# EAGLE design quadcopter-control-board (EAGLE 6.2)
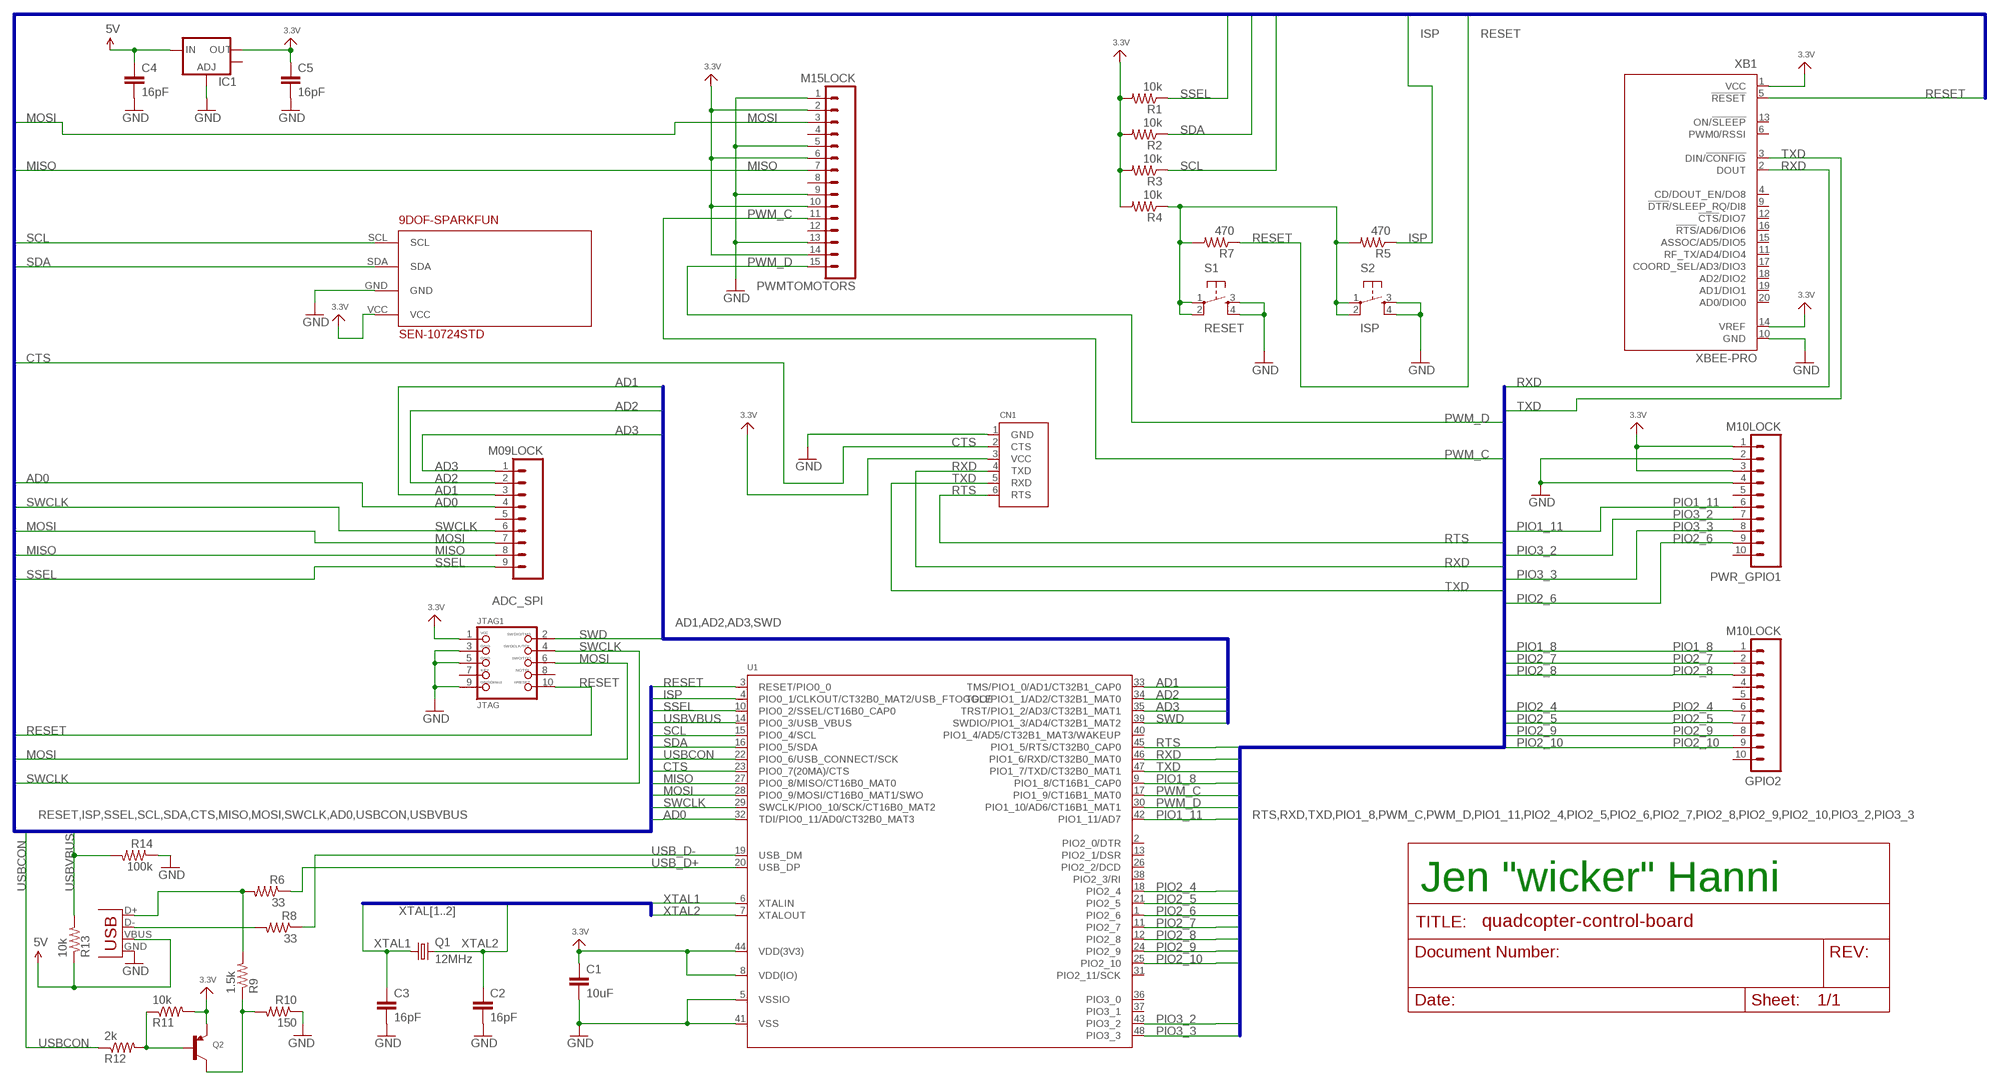
[diagram p0: schematic, sheet 1]

## Parts
9DOF-SPARKFUN  SEN-10724STD  [SPARKFUN-9DOF]
ADC_SPI  M09LOCK  [1X09_LOCK]
C1  10uF  CAP0603-CAP  [0603-CAP]
C2  16pF  CAP0603-CAP  [0603-CAP]
C3  16pF  CAP0603-CAP  [0603-CAP]
C4  16pF  CAP0603-CAP  [0603-CAP]
C5  16pF  CAP0603-CAP  [0603-CAP]
CN1  FTDIUSBCABLE  [1X06_ROUND]
GPIO2  M10LOCK  [1X10_LOCK]
IC1  V_REG_LM1117SOT223  [SOT223]
JTAG1  JTAG  JTAG-CORTEXM3MOLEX  [CORTEXM3_SWD10_MOLEX]
PWMTOMOTORS  M15LOCK  [1X15_LOCK]
PWR_GPIO1  M10LOCK  [1X10_LOCK]
Q1  12MHz  CRYSTALCTS406  [CTS406]
Q2  TRANSISTOR_PNPSOT23-REFLOW  [SOT23-R]
R1  10k  RESISTOR0603-RES  [0603-RES]
R2  10k  RESISTOR0603-RES  [0603-RES]
R3  10k  RESISTOR0603-RES  [0603-RES]
R4  10k  RESISTOR0603-RES  [0603-RES]
R5  470  RESISTOR0603-RES  [0603-RES]
R6  33  RESISTOR0603-RES  [0603-RES]
R7  470  RESISTOR0603-RES  [0603-RES]
R8  33  RESISTOR0603-RES  [0603-RES]
R9  1.5k  RESISTOR0603-RES  [0603-RES]
R10  150  RESISTOR0603-RES  [0603-RES]
R11  10k  RESISTOR0603-RES  [0603-RES]
R12  2k  RESISTOR0603-RES  [0603-RES]
R13  10k  RESISTOR0603-RES  [0603-RES]
R14  100k  RESISTOR0603-RES  [0603-RES]
S1  RESET  TAC_SWITCHSMD  [TACTILE_SWITCH_SMD]
S2  ISP  TAC_SWITCHSMD  [TACTILE_SWITCH_SMD]
U1  LPC1343_QFP  [LQFP48]
X1  USB-SMD-NS  [USB-MINIB-NOSTOP]
XB1  XBEE-PRO  [XBEE-PRO]

## Nets
3.3V: 9DOF-SPARKFUN.VCC C1.1 C5.1 CN1.3(VCC) IC1.2(OUT) JTAG1.1 PWMTOMOTORS.2 PWMTOMOTORS.6 PWMTOMOTORS.10 PWMTOMOTORS.14 PWR_GPIO1.1 PWR_GPIO1.3 Q2.2(E) R1.2 R2.2 R3.2 R4.2 R11.2 U1.8(VDD(IO)) U1.44(VDD(3V3)) XB1.1(VCC) XB1.14(VREF)
5V: C4.1 IC1.3(IN) R13.1 X1.VBUS
AD0: ADC_SPI.4 U1.32(TDI/PIO0_11/AD0/CT32B0_MAT3)
AD1: ADC_SPI.3 U1.33(TMS/PIO1_0/AD1/CT32B1_CAP0)
AD2: ADC_SPI.2 U1.34(TDO/PIO1_1/AD2/CT32B1_MAT0)
AD3: ADC_SPI.1 U1.35(TRST/PIO1_2/AD3/CT32B1_MAT1)
CTS: CN1.2(CTS) U1.23(PIO0_7(20MA)/CTS)
GND: 9DOF-SPARKFUN.GND C1.2 C2.2 C3.2 C4.2 C5.2 CN1.1(GND) IC1.1(ADJ) JTAG1.3 JTAG1.5 JTAG1.9 PWMTOMOTORS.1 PWMTOMOTORS.5 PWMTOMOTORS.9 PWMTOMOTORS.13 PWR_GPIO1.2 PWR_GPIO1.4 R10.1 R14.1 S1.3 S1.4 S2.3 S2.4 U1.5(VSSIO) U1.41(VSS) X1.GND XB1.10(GND)
ISP: R5.1 U1.4(PIO0_1/CLKOUT/CT32B0_MAT2/USB_FTOGGLE)
MISO: ADC_SPI.8 PWMTOMOTORS.7 U1.27(PIO0_8/MISO/CT16B0_MAT0)
MOSI: ADC_SPI.7 JTAG1.6 PWMTOMOTORS.3 U1.28(PIO0_9/MOSI/CT16B0_MAT1/SWO)
N$1: R6.2 R9.2 X1.D+
N$2: R8.2 X1.D-
N$4: Q2.3(C) R9.1 R10.2
N$5: Q2.1(B) R11.1 R12.2
N$7: R4.1 R5.2 R7.2 S1.1 S1.2 S2.1 S2.2
PIO1_8: GPIO2.1 U1.9(PIO1_8/CT16B1_CAP0)
PIO1_11: PWR_GPIO1.6 U1.42(PIO1_11/AD7)
PIO2_4: GPIO2.6 U1.18(PIO2_4)
PIO2_5: GPIO2.7 U1.21(PIO2_5)
PIO2_6: PWR_GPIO1.9 U1.1(PIO2_6)
PIO2_7: GPIO2.2 U1.11(PIO2_7)
PIO2_8: GPIO2.3 U1.12(PIO2_8)
PIO2_9: GPIO2.8 U1.24(PIO2_9)
PIO2_10: GPIO2.9 U1.25(PIO2_10)
PIO3_2: PWR_GPIO1.7 U1.43(PIO3_2)
PIO3_3: PWR_GPIO1.8 U1.48(PIO3_3)
PWM_C: PWMTOMOTORS.11 U1.17(PIO1_9/CT16B1_MAT0)
PWM_D: PWMTOMOTORS.15 U1.30(PIO1_10/AD6/CT16B1_MAT1)
RESET: JTAG1.10 R7.1 U1.3(RESET/PIO0_0) XB1.5(!RESET)
RTS: CN1.6(RTS) U1.45(PIO1_5/RTS/CT32B0_CAP0)
RXD: CN1.4(TXD) U1.46(PIO1_6/RXD/CT32B0_MAT0) XB1.2(DOUT)
SCL: 9DOF-SPARKFUN.SCL R3.1 U1.15(PIO0_4/SCL)
SDA: 9DOF-SPARKFUN.SDA R2.1 U1.16(PIO0_5/SDA)
SSEL: ADC_SPI.9 R1.1 U1.10(PIO0_2/SSEL/CT16B0_CAP0)
SWCLK: ADC_SPI.6 JTAG1.4 U1.29(SWCLK/PIO0_10/SCK/CT16B0_MAT2)
SWD: JTAG1.2 U1.39(SWDIO/PIO1_3/AD4/CT32B1_MAT2)
TXD: CN1.5(RXD) U1.47(PIO1_7/TXD/CT32B0_MAT1) XB1.3(DIN/!CONFIG)
USB_D+: R6.1 U1.20(USB_DP)
USB_D-: R8.1 U1.19(USB_DM)
USBCON: R12.1 U1.22(PIO0_6/USB_CONNECT/SCK)
USBVBUS: R13.2 R14.2 U1.14(PIO0_3/USB_VBUS)
XTAL1: C3.1 Q1.1 U1.6(XTALIN)
XTAL2: C2.1 Q1.3 U1.7(XTALOUT)
Unconnected: ADC_SPI.5 GPIO2.4 GPIO2.5 GPIO2.10 IC1.4(OUT) JTAG1.7 JTAG1.8 PWMTOMOTORS.4 PWMTOMOTORS.8 PWMTOMOTORS.12 PWR_GPIO1.5 PWR_GPIO1.10 U1.2(PIO2_0/DTR) U1.13(PIO2_1/DSR) U1.26(PIO2_2/DCD) U1.31(PIO2_11/SCK) U1.36(PIO3_0) U1.37(PIO3_1) U1.38(PIO2_3/RI) U1.40(PIO1_4/AD5/CT32B1_MAT3/WAKEUP) XB1.4(CD/DOUT_EN/DO8) XB1.6(PWM0/RSSI) XB1.9(!DTR!/SLEEP_RQ/DI8) XB1.11(RF_TX/AD4/DIO4) XB1.12(!CTS!/DIO7) XB1.13(ON/!SLEEP) XB1.15(ASSOC/AD5/DIO5) XB1.16(!RTS!/AD6/DIO6) XB1.17(COORD_SEL/AD3/DIO3) XB1.18(AD2/DIO2) XB1.19(AD1/DIO1) XB1.20(AD0/DIO0)

## Buses
XTAL[1..2]
RESET,ISP,SSEL,SCL,SDA,CTS,MISO,MOSI,SWCLK,AD0,USBCON,USBVBUS
AD1,AD2,AD3,SWD
RTS,RXD,TXD,PIO1_8,PWM_C,PWM_D,PIO1_11,PIO2_4,PIO2_5,PIO2_6,PIO2_7,PIO2_8,PIO2_9,PIO2_10,PIO3_2,PIO3_3

## Notes on the sheet
- Jen "wicker" Hanni

## Library data of the parts
9DOF-SPARKFUN = wicker:SEN-10724
ADC_SPI = sparkfun:M09: Header 9 Standard 9-pin 0.1" header. Use with straight break away headers (SKU : PRT-00116), right angle break away headers (PRT-00553), swiss pins (PRT-00743), machine pins (PRT-00117), and female headers (PRT-00115).
C1-C5 = sparkfun:CAP: Capacitor Standard 0603 ceramic capacitor, and 0.1" leaded capacitor.
CN1 = microbuilder:FTDIUSBCABLE: FTDI TTL-232R USB Cable Connector for FTDI's USB->RS232 Cable
GPIO2 PWR_GPIO1 = sparkfun:M10: Header 10 Standard 10-pin 0.1" header. Use with straight break away headers (SKU : PRT-00116), right angle break away headers (PRT-00553), swiss pins (PRT-00743), machine pins (PRT-00117), and female headers (PRT-00115).
IC1 = sparkfun:V_REG_LM1117: Voltage Regulator LM1117 Standard adjustable voltage regulator but in SMD form. Spark Fun Electronics SKU : COM-00595
JTAG1 = microbuilder:JTAG-CORTEXM3: Serial Wire (SW-DP) Connector This standard 0.05" 10-pin connector is for use with the Cortex M0/M3's native SWD (serial wire debugger) interface (SW-DP). Some boards support a 20-pin combined JTAG+SWD connector (SWJ-DP), such as the LPC1700 family, but many smaller devices only work with SWD which typically use the smaller 10-pin SW-DP connecter (the LPC1300 family, for example, only supports SWD). 2x05 1.27mm/0.05" Connector: This is the standard SMT connector defined by ARM for all Cortex devices, and should be used in most situations and for forward-compatibility since any new devices coming to market will likely use this connector. MOLEX 10 Pin 0.1" Connector: This 0.1" 10 pin connector has the same pin layout as the standard 0.05" connector, but is easier to work with if you are using standard jumper wires or custom cables to connect your SWD hardware. MOLEX 20 Pin 0.1" Connector: This 0.1" 20 pin connector is the same model used for ARM7/ARM9 JTAG debuggers, but is connected to match the pins on the Segger J-Link for ARM (which supports both JTAG and SWD debugging). See the following document from ARM for more information on Cortex M3 Debug Connectors: http://infocenter.arm.com/help/topic/com.arm.doc.faqs/attached/13634/cortex_debug_connectors.pdf And the following page for an overview with images of the different connector types: http://www.keil.com/peripherals/coresight/connectors.asp
PWMTOMOTORS = sparkfun:M15: Header 15 Standard 15-pin 0.1" header. Use with straight break away headers (SKU : PRT-00116), right angle break away headers (PRT-00553), swiss pins (PRT-00743), machine pins (PRT-00117), and female headers (PRT-00115).
Q1 = crystal:CRYSTAL: CRYSTAL
Q2 = microbuilder:TRANSISTOR_PNP: PNP Transistor Transistor (PNP) 800mA 60V, 1.6V VCE @ 500mA [Digikey: MMBT2907AFSTR-ND] Transistor (PNP) Low Sat - 1.5A 20V, 260mV VCE @ 400mA [Digikey: ZXTP25020DFLTR-ND] SOT23-R - SOT23 footprint optimised for use with solder paste and reflow ovens. SOT23-W - SOT23 footprint optimised for hand-soldering (larger pads).
R1-R14 = sparkfun:RESISTOR: Resistor Basic schematic elements and footprints for 0603, 1206, and PTH resistors.
S1 S2 = sparkfun:TAC_SWITCH: Momentary Switch Button commonly used for reset or general input. Spark Fun Electronics SKU : COM-00097
U1 = microbuilder:LPC1343_QFP: LPC1343 72 MHz 32-bit ARM Cortex-M3 microcontroller. 32 kB Flash, 8 kB SRAM, USB Device Mouser: 771-LPC1343FBD48151 Digikey: 568-4945-ND; DIGIKEY#: 568-4945-ND; MANF: NXP; MANF#: LPC1343FBD48,151
X1 = sparkfun:USB: USB Connectors USB-B-PTH is fully proven SKU : PRT-00139 USB-miniB is fully proven SKU : PRT-00587 USB-A-PCB is untested. USB-A-H is throughly reviewed, but untested. Spark Fun Electronics SKU : PRT-00437 USB-B-SMT is throughly reviewed, but untested. Needs silkscreen touching up. USB-A-S has not been used/tested USB-MB-H has not been used/tested
XB1 = microbuilder:XBEE: XBee (TM) /XBee-PRO(TM) OEM RF Modules Source: MaxStream, Inc. xbee_productmanual.pdf

## Board
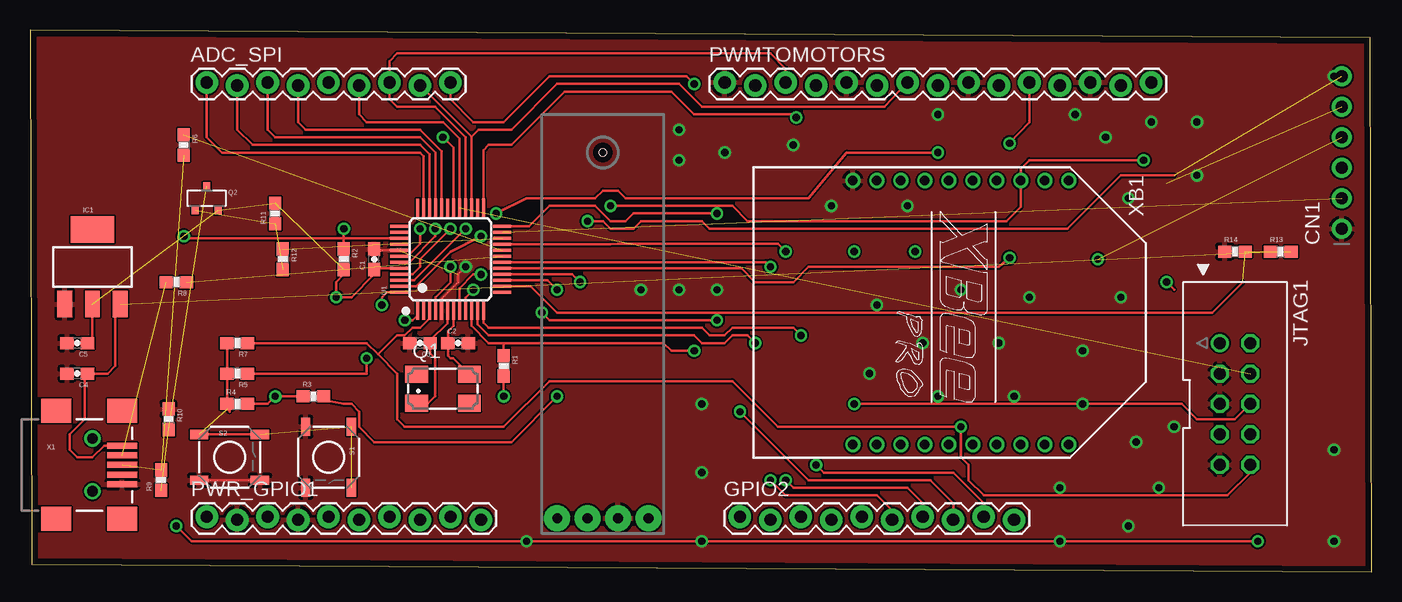
[diagram p1: board, top side]
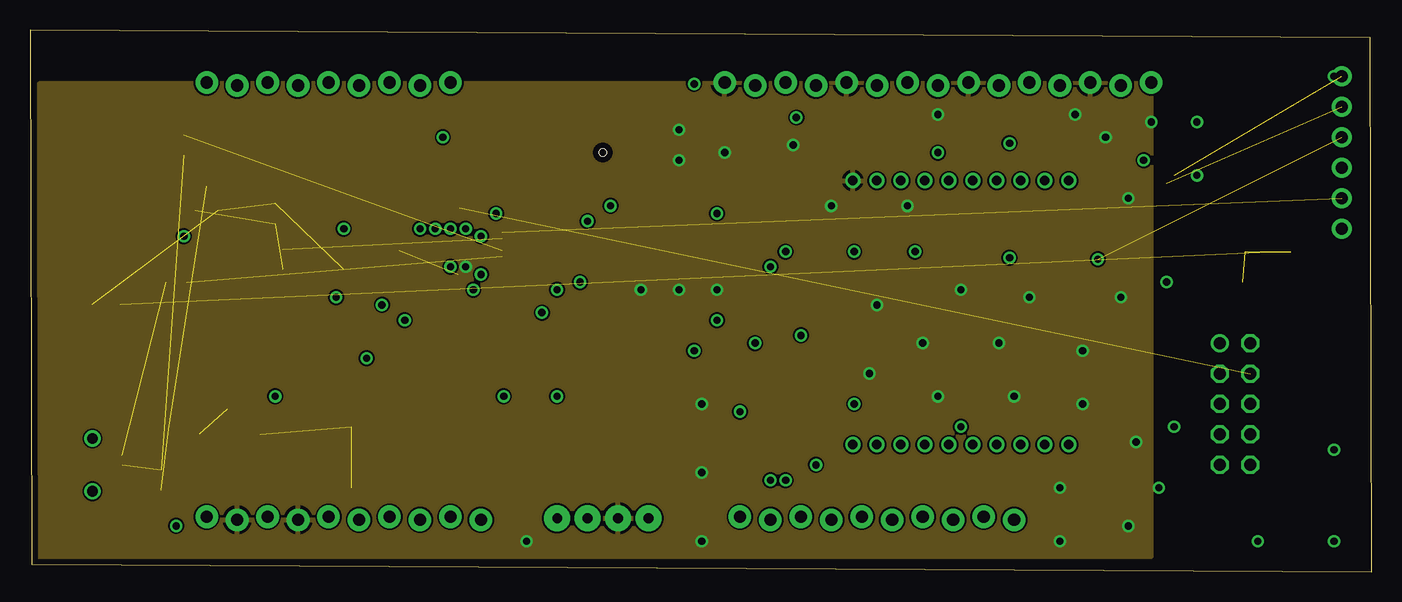
[diagram p2: board, inner layer $GND]
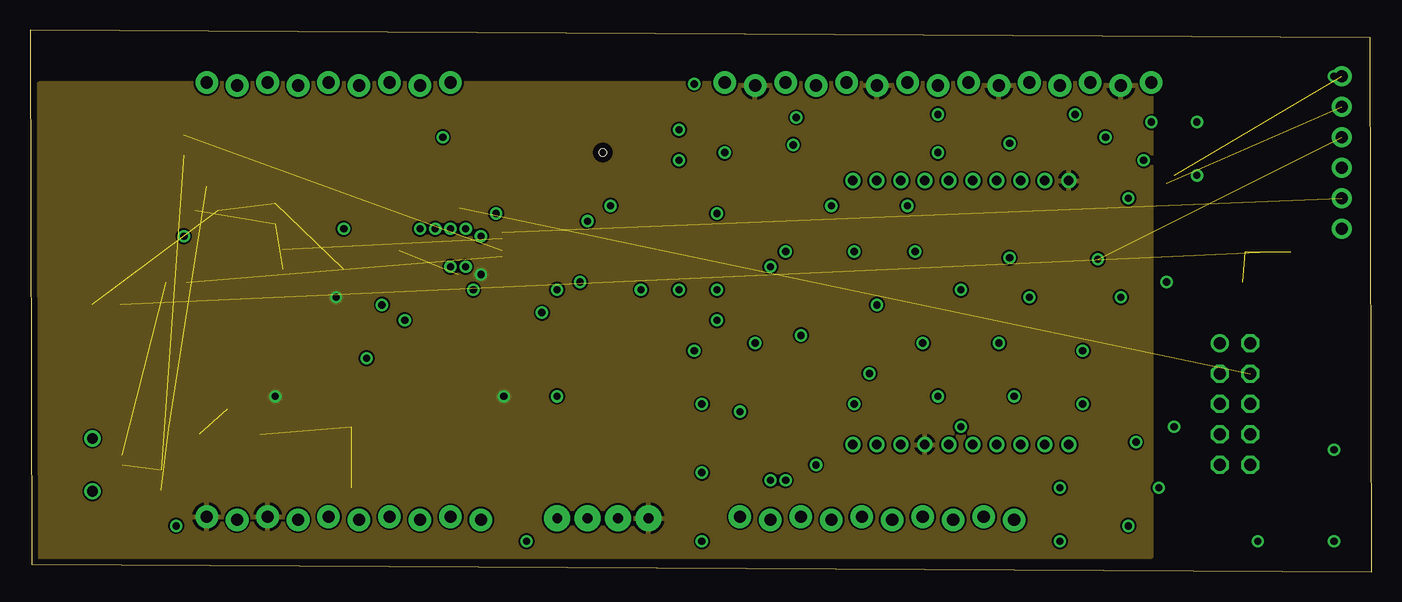
[diagram p3: board, inner layer $3.3V]
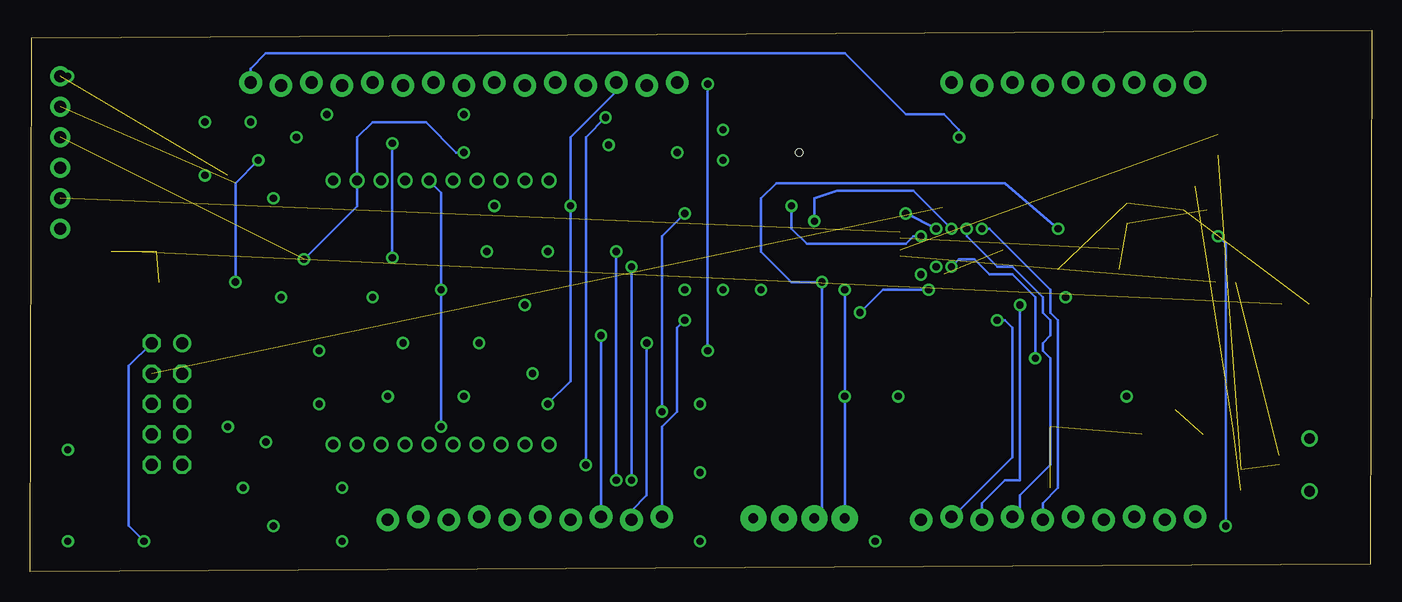
[diagram p4: board, bottom side, seen from below]

Size 111.87 x 45.14 mm. Coordinates in mm from the lower left corner, seen from the top.
Outline: 0.13,0.64 111.87,0 111.74,44.5 0,45.14 0.13,0.64
Copper layers (1+2*3+16): Top 0.0432mm / dielectric 0.3048mm / $GND 0.0356mm / dielectric 0.7112mm / $3.3V 0.0356mm / dielectric 0.3048mm / Bottom 0.0432mm
Design rules "eagle_sunstone_4lr_rules_v1.3_modifid": minimum track width 6mil, minimum drill 8mil, track to track 6mil, track to pad 6mil, pad to pad 6mil, via to via 6mil, smd to smd 6mil, copper to edge 20mil, drill to drill 16mil, minimum pad ring 0.2118mm, minimum via ring 0.2118mm, stop-mask expansion 3mil, vias tented up to drill 0mil, thermal gap 10mil

### Footprints (pad centres in the part's own frame; a part is rotated, then mirrored left to right if it is on the bottom)
SPARKFUN-9DOF = drill 0.8 pad 2.184 round: GND 1.27,3.81; SCL 1.27,8.89; SDA 1.27,6.35; VCC 1.27,1.27 | hole 0.6: 31.75,5.08
1X09_LOCK = drill 1.016 pad 1.88 round: 1 0,0.127; 2 2.54,-0.127; 3 5.08,0.127; 4 7.62,-0.127; 5 10.16,0.127; 6 12.7,-0.127; 7 15.24,0.127; 8 17.78,-0.127; 9 20.32,0.127
0603-CAP = smd 1.1 x 1: 1 -0.85,0; 2 0.85,0
1X06_ROUND = drill 1 pad 1.676 round: 1 -6.35,0; 2 -3.81,0; 3 -1.27,0; 4 1.27,0; 5 3.81,0; 6 6.35,0
1X10_LOCK = drill 1.016 pad 1.88 round: 1 0,0.127; 2 2.54,-0.127; 3 5.08,0.127; 4 7.62,-0.127; 5 10.16,0.127; 6 12.7,-0.127; 7 15.24,0.127; 8 17.78,-0.127; 9 20.32,0.127; 10 22.86,-0.127
SOT223 = smd 1.219 x 2.235: 1 -2.311,-3.099; 2 0,-3.099; 3 2.311,-3.099 | smd 3.6 x 2.2: 4 0,3.099
CORTEXM3_SWD10_MOLEX = drill 1 round: 1 -5.08,-1.27 | drill 1 octagon: 2 -5.08,1.27; 3 -2.54,-1.27; 4 -2.54,1.27; 5 0,-1.27; 6 0,1.27; 7 2.54,-1.27; 8 2.54,1.27; 9 5.08,-1.27; 10 5.08,1.27
1X15_LOCK = drill 1.016 pad 1.88 round: 1 0,0.127; 2 2.54,-0.127; 3 5.08,0.127; 4 7.62,-0.127; 5 10.16,0.127; 6 12.7,-0.127; 7 15.24,0.127; 8 17.78,-0.127; 9 20.32,0.127; 10 22.86,-0.127; 11 25.4,0.127; 12 27.94,-0.127; 13 30.48,0.127; 14 33.02,-0.127; 15 35.56,0.127
CTS406 = smd 1.9 x 1.4: 1 -2.2,-1.2; 2 2.2,-1.2; 3 2.2,1.2; 4 -2.2,1.2
SOT23-R = smd 0.6 x 0.7: 1 -0.95,-1; 2 0.95,-1; 3 0,1
0603-RES = smd 1.1 x 1: 1 -0.85,0; 2 0.85,0
TACTILE_SWITCH_SMD = smd 1.524 x 0.762: 1 -2.54,1.905; 2 2.54,1.905; 3 -2.54,-1.905; 4 2.54,-1.905
LQFP48 = smd 1.5 x 0.25: 1 -4.3,2.75; 2 -4.3,2.25; 3 -4.3,1.75; 4 -4.3,1.25; 5 -4.3,0.75; 6 -4.3,0.25; 7 -4.3,-0.25; 8 -4.3,-0.75; 9 -4.3,-1.25; 10 -4.3,-1.75; 11 -4.3,-2.25; 12 -4.3,-2.75; 25 4.3,-2.75; 26 4.3,-2.25; 27 4.3,-1.75; 28 4.3,-1.25; 29 4.3,-0.75; 30 4.3,-0.25; 31 4.3,0.25; 32 4.3,0.75; 33 4.3,1.25; 34 4.3,1.75; 35 4.3,2.25; 36 4.3,2.75 | smd 0.25 x 1.5: 13 -2.75,-4.3; 14 -2.25,-4.3; 15 -1.75,-4.3; 16 -1.25,-4.3; 17 -0.75,-4.3; 18 -0.25,-4.3; 19 0.25,-4.3; 20 0.75,-4.3; 21 1.25,-4.3; 22 1.75,-4.3; 23 2.25,-4.3; 24 2.75,-4.3; 37 2.75,4.3; 38 2.25,4.3; 39 1.75,4.3; 40 1.25,4.3; 41 0.75,4.3; 42 0.25,4.3; 43 -0.25,4.3; 44 -0.75,4.3; 45 -1.25,4.3; 46 -1.75,4.3; 47 -2.25,4.3; 48 -2.75,4.3
USB-MINIB-NOSTOP = smd 2.5 x 0.5: D+ 2.5,0; D- 2.5,0.8; GND 2.5,-1.6; ID 2.5,-0.8; VBUS 2.5,1.6 | smd 2.5 x 2: G1 -3,-4.5; G2 -3,4.5; G3 2.5,4.5; G4 2.5,-4.5 | drill 0.9 pad 0.8 round: H1 0,2.2 | drill 0.9 pad 0.787 round: H2 0,-2.2
XBEE-PRO = drill 0.8 pad 1.27 round: 1 -11,9; 2 -11,7; 3 -11,5; 4 -11,3; 5 -11,1; 6 -11,-1; 7 -11,-3; 8 -11,-5; 9 -11,-7; 10 -11,-9; 11 11,-9; 12 11,-7; 13 11,-5; 14 11,-3; 15 11,-1; 16 11,1; 17 11,3; 18 11,5; 19 11,7; 20 11,9

### Placement (x,y rotation side)
9DOF-SPARKFUN  52.83,3.17 90 top
ADC_SPI  14.73,40.64 0 top
C1  28.7,26.04 90 top
C2  35.69,19.05 0 top
C3  32.51,19.05 180 top
C4  3.94,16.51 180 top
C5  3.94,19.05 180 top
CN1  109.35,34.92 90 top
GPIO2  59.18,4.45 0 top
IC1  5.21,25.4 0 top
JTAG1  100.46,13.97 270 top
PWMTOMOTORS  57.91,40.64 0 top
PWR_GPIO1  14.73,4.45 0 top
Q1  34.42,15.24 0 top
Q2  14.73,31.12 0 top
R1  39.5,17.15 270 top
R2  26.16,26.04 270 top
R3  23.62,14.61 0 top
R4  17.27,13.97 0 top
R5  17.27,16.51 180 top
R6  12.83,35.56 270 top
R7  17.27,19.05 180 top
R8  12.19,24.13 180 top
R9  10.92,7.62 90 top
R10  11.56,12.7 270 top
R11  20.45,29.85 90 top
R12  21.08,26.04 270 top
R13  104.27,26.67 0 top
R14  100.46,26.67 0 top
S1  24.89,9.53 270 top
S2  16.64,9.53 0 top
U1  35.05,26.04 90 top
X1  5.21,8.89 0 top
XB1  77.6,21.59 270 top

### Tracks (layer width: path | path; a pad name or v marks a point on that pad's centre or on a via)
3.3V  (via drill 0.6)  (3 unrouted)
  Top 0.203: v39.5,14.61 R1.2 | R2.2 26.16,24.77 25.53,24.13 v25.53,22.86 26.8,22.86 28.7,24.77 C1.1 28.8,25.29 U1.44 | U1.8 35.8,23.61 36.96,24.77 v37.59,24.77 | R3.2 v20.45,14.61 19.81,13.97 R4.2 | IC1.2 5.21,19.47 C5.1
  pour $3.3V: 0.76,40.64 0.76,1.27 93.47,1.27 93.47,40.64
5V  (1 unrouted)
  Top 0.203: X1.VBUS 6.17,10.49 5.21,9.53 3.94,9.53 3.3,10.16 3.3,11.43 4.57,12.7 4.57,16.3 C4.1 6.48,16.51 7.11,17.15 7.11,21.9 IC1.3
AD0
  Top 0.203: U1.32 34.3,35.04 32.51,36.83 22.99,36.83 22.35,37.46 ADC_SPI.4
AD1
  Top 0.203: U1.33 33.8,34.91 32.51,36.2 20.45,36.2 19.81,36.83 ADC_SPI.3
AD2
  Top 0.203: U1.34 33.3,34.77 32.51,35.56 18.54,35.56 17.27,36.83 ADC_SPI.2
AD3
  Top 0.203: ADC_SPI.1 14.73,36.2 16,34.92 32.51,34.92 32.8,34.63 U1.35
CTS  (1 unrouted)
GND  (via drill 0.6, 0.6 pad 0.2)  (1 unrouted)
  Top 0.203: C1.2 28.8,26.79 U1.41 28.59,26.79 | S2.3 S2.4 | U1.5 34.3,22.75 35.69,24.13 35.69,24.77 v36.32,25.4
  other vias: 54.1,36.83 54.1,34.29 57.91,34.92 63.63,35.56 66.8,30.48 73.15,30.48 75.69,38.1 50.93,23.5 57.28,23.5 54.1,23.5 41.4,2.54 56.01,2.54 56.01,8.26 56.01,13.97 69.98,16.51 74.42,19.05 70.61,22.23 77.6,23.5 83.31,22.86 87.76,18.42 82.04,14.61 80.77,19.05 75.69,14.61 87.76,13.97 92.2,10.79 95.38,12.06 108.71,10.16 94.11,6.98 108.71,2.54 91.57,3.81 85.85,2.54 85.85,6.98 97.28,33.02 97.28,37.46 108.71,41.27 93.47,37.46 89.66,36.2 87.12,38.1 91.57,31.12 90.93,22.86
  pour $GND: 0.76,40.64 0.76,1.27 93.47,1.27 93.47,40.64
  pour Top: 0.76,44.45 111.25,43.81 111.25,0.64 0.76,1.27
ISP  (via drill 0.6)
  Top 0.203: v28.07,17.78 28.07,16.51 R5.1 | U1.4 33.8,22.88 35.05,24.13 v35.05,25.4
  Bottom 0.203: v28.07,17.78 28.07,22.86 29.97,24.77 31.88,24.77 33.15,26.04 34.42,26.04 v35.05,25.4
MISO
  Top 0.203: 36.8,36.22 U1.27 36.81,30.34 | 36.8,36.22 ADC_SPI.8 | PWMTOMOTORS.7 71.25,38.73 56.01,38.73 54.1,40.64 43.94,40.64 40.13,36.83 37.41,36.83 36.8,36.22
MOSI  (via drill 0.6)
  Top 0.203: U1.28 36.3,36.21 33.78,38.73 30.61,38.73 29.97,39.37 ADC_SPI.7 29.97,42.54 30.61,43.18 61.72,43.18 62.99,41.91 PWMTOMOTORS.3 | v68.71,13.97 96.01,13.97 97.28,12.7 100.46,12.7 JTAG1.6
  Bottom 0.203: PWMTOMOTORS.3 62.99,40 66.8,36.2 66.8,15.88 v68.71,13.97
N$1  (2 unrouted)
N$2  (1 unrouted)
N$4  (2 unrouted)
N$5  (2 unrouted)
N$7  (3 unrouted)
  Top 0.203: S2.1 S2.2 | R7.2 R5.2 R4.1 | R4.1 16.42,13.55 16.64,13.33 16.64,13.75 R4.1
N$61  (via drill 0.6 pad 0.2)
  other vias: 73.79,26.67
N$62  (via drill 0.6 pad 0.2)
  other vias: 68.71,26.67
PIO1_8  (via drill 0.6)
  Top 0.203: U1.9 36.3,22.84 v36.96,23.5 | v42.67,21.59 43.31,20.96 v57.28,20.96
  Bottom 0.203: GPIO2.1 59.18,12.06 57.91,13.33 57.91,20.32 v57.28,20.96 | v36.96,23.5 40.77,23.5 v42.67,21.59
PIO1_11  (via drill 0.6)
  Top 0.203: U1.42 31.49,26.29 32.51,27.31 v32.51,28.58
  Bottom 0.203: v32.51,28.58 31.88,28.58 26.8,23.5 26.8,21.59 26.16,20.96 26.16,6.98 27.43,5.71 PWR_GPIO1.6
PIO2_4  (via drill 0.6)
  Top 0.203: GPIO2.6 71.88,5.08 70.61,6.35 62.99,6.35 v61.72,7.62 | U1.18 61.34,25.79 v61.72,25.4
  Bottom 0.203: v61.72,25.4 v61.72,7.62
PIO2_5  (via drill 0.6)
  Top 0.203: GPIO2.7 74.42,5.71 73.15,6.98 63.63,6.98 v62.99,7.62 | U1.21 48.41,27.29 49.02,27.31 62.36,27.31 v62.99,26.67
  Bottom 0.203: v62.99,26.67 v62.99,7.62
PIO2_6  (via drill 0.6)
  Top 0.203: U1.1 32.3,21.38 31.88,20.96 v31.24,20.96
  Bottom 0.203: PWR_GPIO1.9 34.93,4.57 29.97,9.53 29.97,20.32 30.61,20.96 v31.24,20.96
PIO2_7  (via drill 0.6)
  Top 0.203: v60.45,19.05 59.82,19.69 58.55,19.69 57.91,19.05 56.01,19.05 55.37,19.69 38.23,19.69 37.3,20.61 U1.11
  Bottom 0.203: v60.45,19.05 60.45,6.35 61.72,5.08 GPIO2.2
PIO2_8  (via drill 0.6)
  Top 0.203: v64.26,19.69 63.63,20.32 58.55,20.32 57.91,19.69 56.64,19.69 56.01,20.32 38.23,20.32 37.8,20.75 U1.12
  Bottom 0.203: v64.26,19.69 GPIO2.3
PIO2_9  (via drill 0.6)
  Top 0.203: GPIO2.8 76.96,5.71 75.06,7.62 64.9,7.62 v59.18,13.33 | v57.28,29.85 50.29,29.85 49.66,29.21 48.39,29.21 47.12,30.48 43.31,30.48 41.61,28.79 U1.24
  Bottom 0.203: v59.18,13.33 59.18,27.94 v57.28,29.85
PIO2_10  (via drill 0.6)
  Top 0.203: U1.25 37.8,35.13 38.23,35.56 40.13,35.56 44.58,40 53.47,40 55.37,38.1 63.63,38.1 v63.88,37.85 | GPIO2.9 79.5,5.71 76.96,8.26 66.17,8.26 v65.53,8.89
  Bottom 0.203: v65.53,8.89 65.53,36.2 v63.88,37.85
PIO3_2  (via drill 0.6)
  Top 0.203: U1.43 31.63,25.79 33.78,27.94 v33.78,28.58
  Bottom 0.203: v33.78,28.58 33.78,27.94 31.24,25.4 29.97,25.4 27.43,22.86 27.43,21.59 26.8,20.96 26.8,19.69 27.43,19.05 27.43,18.42 26.8,17.78 26.8,8.89 29.34,6.35 29.34,5.21 PWR_GPIO1.7
PIO3_3  (via drill 0.6)
  Top 0.203: U1.48 29.76,23.29 29.34,22.86 v29.34,22.23
  Bottom 0.203: v29.34,22.23 29.34,7.62 30.61,7.62 32.51,5.71 PWR_GPIO1.8
PWM_C  (via drill 0.6)
  Top 0.203: PWMTOMOTORS.11 83.31,37.46 v81.66,35.69 | U1.17 59.3,25.29 60.45,24.13 63.63,24.13 64.9,25.4 80.77,25.4 v81.66,26.16
  Bottom 0.203: v81.66,26.16 v81.66,35.69
PWM_D  (via drill 0.6)
  Top 0.203: U1.30 35.3,35.31 v34.42,36.2
  Bottom 0.203: v34.42,36.2 34.42,36.83 35.69,38.1 38.86,38.1 43.94,43.18 92.2,43.18 93.47,41.91 PWMTOMOTORS.15
RESET  (via drill 0.6)
  Top 0.203: JTAG1.10 101.73,8.26 99.82,6.35 79.5,6.35 78.23,7.62 78.23,8.89 77.6,9.53 v77.6,12.06 62.36,12.06 58.55,15.88 43.31,15.88 39.5,12.06 31.24,12.06 30.61,12.7 30.61,16.51 29.02,18.1 | R7.1 28.07,19.05 29.02,18.1 | U1.3 33.3,21.11 32.51,20.32 31.88,20.32 31.24,19.69 30.61,19.69 29.02,18.1
  Bottom 0.203: v77.6,12.06 77.6,31.59 XB1.5
RTS  (via drill 0.6)  (1 unrouted)
  Top 0.203: 95.38,33.02 90.93,33.02 86.49,28.58 56.64,28.58 56.01,29.21 50.93,29.21 50.29,28.58 48.39,28.58 47.75,29.21 v46.48,29.21 | U1.45 31.9,24.79 32.51,25.4 32.51,26.04 v35.05,28.58
  Bottom 0.203: v35.05,28.58 38.23,31.75 44.58,31.75 46.48,31.12 v46.48,29.21
RXD  (via drill 0.6)  (1 unrouted)
  Top 0.203: v75.69,34.92 68.07,34.92 64.9,31.12 49.66,31.12 49.02,31.75 47.75,31.75 47.12,31.12 41.4,31.12 v38.86,29.85 | U1.46 32.03,24.29 v36.32,28.58
  Bottom 0.203: v75.69,34.92 76.33,34.92 78.87,37.46 83.31,37.46 84.58,36.2 84.58,32.6 XB1.2 84.6,30.46 v89.03,26.04 | v36.32,28.58 v38.86,29.85
SCL  (via drill 0.6)
  Top 0.203: U1.15 43.15,24.29 v43.94,23.5 | R3.1 26.16,13.97 26.8,13.97 27.43,13.33 27.43,12.06 28.7,10.79 40.13,10.79 v43.94,14.61
  Bottom 0.203: 9DOF-SPARKFUN.SCL v43.94,14.61 v43.94,23.5
SDA  (via drill 0.6)
  Top 0.203: U1.16 45.19,24.79 v45.85,24.13 | v26.16,28.58 R2.1
  Bottom 0.203: 9DOF-SPARKFUN.SDA 45.85,5.08 v45.85,24.13 48.39,24.13 50.93,26.67 50.93,31.12 49.66,32.38 30.61,32.38 v26.16,28.58
SSEL  (via drill 0.6)
  Top 0.203: 39.5,19.05 52.83,19.05 53.47,18.42 v55.37,18.42 | ADC_SPI.9 35.05,39.37 36.96,37.46 39.5,37.46 43.31,41.27 54.74,41.27 v55.37,40.64 | U1.10 36.8,20.48 38.23,19.05 39.5,19.05 | R1.1 39.5,19.05
  Bottom 0.203: v55.37,18.42 v55.37,40.64
SWCLK  (1 unrouted)
  Top 0.203: U1.29 35.8,36.08 34.42,37.46 28.07,37.46 27.43,38.1 ADC_SPI.6
SWD  (via drill 0.6)
  Top 0.203: v102.36,2.54 13.46,2.54 v12.19,3.81 | U1.39 12.98,27.79 v12.83,27.94
  Bottom 0.203: JTAG1.2 103.63,17.15 103.63,3.81 v102.36,2.54 | v12.19,3.81 12.19,27.31 v12.83,27.94
TXD  (via drill 0.6)  (1 unrouted)
  Top 0.203: v92.84,34.29 83.31,34.29 82.6,33.57 XB1.3 82.6,30.4 81.41,29.21 59.82,29.21 58.55,30.48 v48.39,30.48 | U1.47 32.17,23.79 35.05,26.67 v37.59,27.94 | v94.74,24.13 95.38,23.5
  Bottom 0.203: v48.39,30.48 48.39,28.58 47.12,27.31 38.86,27.31 38.23,27.94 v37.59,27.94 | v94.74,24.13 94.74,32.38 v92.84,34.29
USB_D+  (1 unrouted)
USB_D-  (1 unrouted)
USBCON  (1 unrouted)
USBVBUS  (2 unrouted)
  Top 0.203: U1.14 41.75,23.79 43.94,21.59 98.55,21.59 101.09,24.13
XTAL1
  Top 0.203: Q1.1 32.29,13.97 33.15,13.97 33.78,14.61 33.78,17.78 33.36,18.2 C3.1 33.36,19.27 34.8,20.71 U1.6
XTAL2
  Top 0.203: 36.54,16.52 Q1.3 35.28,17.78 35.05,17.78 34.84,18 C2.1 34.84,20.03 35.3,20.49 U1.7